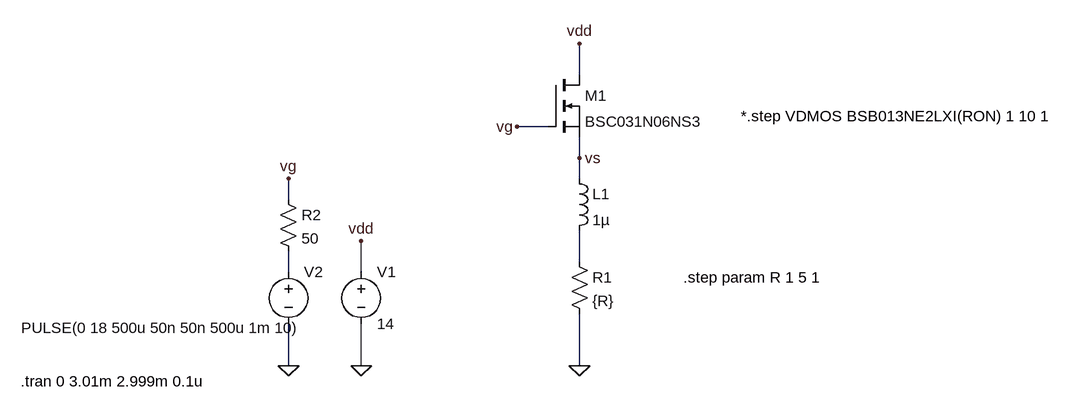
[diagram p0: schematic ind_last.asc]
ind_last.asc, the LTspice schematic file:
Version 4
SHEET 1 1172 680
WIRE 224 -144 224 -192
WIRE 176 -64 128 -64
WIRE 224 -16 224 -48
WIRE 224 16 224 -16
WIRE -224 48 -224 16
WIRE 224 144 224 96
WIRE -224 160 -224 128
WIRE -112 160 -112 112
WIRE -224 304 -224 240
WIRE -112 304 -112 240
WIRE 224 304 224 224
FLAG 224 304 0
FLAG -224 304 0
FLAG -112 304 0
FLAG -112 112 vdd
FLAG -224 16 vg
FLAG 224 -192 vdd
FLAG 128 -64 vg
FLAG 224 -16 vs
SYMBOL voltage -112 144 R0
SYMATTR InstName V1
SYMATTR Value 14
SYMBOL voltage -224 144 R0
WINDOW 3 -411 102 Left 2
WINDOW 123 0 0 Left 2
WINDOW 39 0 0 Left 2
SYMATTR InstName V2
SYMATTR Value PULSE(0 18 500u 50n 50n 500u 1m 10)
SYMBOL nmos 176 -144 R0
SYMATTR InstName M1
SYMATTR Value BSC031N06NS3
SYMBOL ind 208 0 R0
SYMATTR InstName L1
SYMATTR Value 1µ
SYMBOL res 208 128 R0
SYMATTR InstName R1
SYMATTR Value {R}
SYMATTR SpiceLine tol=1 pwr=0.1
SYMBOL res -240 32 R0
SYMATTR InstName R2
SYMATTR Value 50
TEXT -636 328 Left 2 !.tran 0 3.01m 2.999m 0.1u
TEXT 472 -80 Left 2 !*.step VDMOS BSB013NE2LXI(RON) 1 10 1
TEXT 384 168 Left 2 !.step param R 1 5 1

The netlist it stands for:
* ind_last.asc
V1 vdd 0 14
V2 N002 0 PULSE(0 18 500u 50n 50n 500u 1m 10)
M1 vdd vg vs vs BSC031N06NS3
L1 vs N001 1µ
R1 N001 0 {R} tol=1 pwr=0.1
R2 vg N002 50
.model NMOS NMOS
.model PMOS PMOS
.lib standard.mos
.tran 0 3.01m 2.999m 0.1u
*.step VDMOS BSB013NE2LXI(RON) 1 10 1
.step param R 1 5 1
.backanno
.end

* Results of the author's LTspice run, read from the files saved beside the schematic
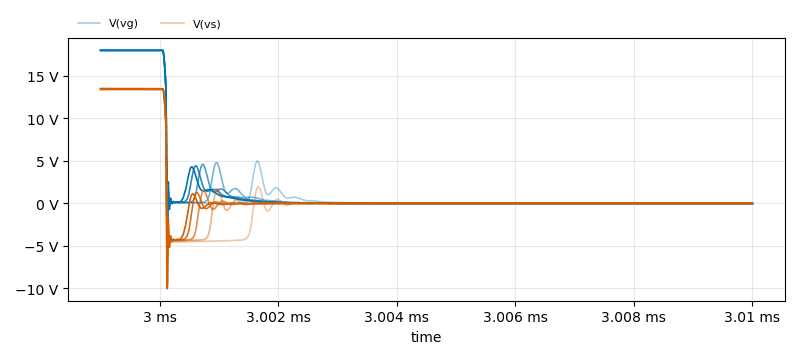
[diagram p1: Transient Analysis of ind_last.asc, plotted from the saved traces]
* Transient Analysis, 9 runs:
*   V(vg) [run 1]: min -2.129 V, max 18 V, average 1.971 V, rms 5.718 V, last 0 V
*   V(vg) [run 2]: 18 V at time=2.999 ms, 18 V at time=2.999 ms, min 18 V, max 18 V
*   V(vg) [run 3]: min -3.089 V, max 18 V, average 1.968 V, rms 5.718 V, last 0 V
*   V(vg) [run 4]: 18 V at time=2.999 ms, 18 V at time=2.999 ms, min 18 V, max 18 V
*   V(vg) [run 5]: min -3.784 V, max 18 V, average 1.967 V, rms 5.717 V, last 0 V
*   V(vg) [run 6]: 18 V at time=2.999 ms, 18 V at time=2.999 ms, min 18 V, max 18 V
*   V(vg) [run 7]: min -4.751 V, max 18 V, average 1.966 V, rms 5.717 V, last 0 V
*   V(vg) [run 8]: 18 V at time=2.999 ms, 18 V at time=2.999 ms, min 18 V, max 18 V
*   V(vs) [run 1]: min -6.828 V, max 13.33 V, average 771.5 mV, rms 4.499 V, last 0 V
*   V(vs) [run 2]: 13.42 V at time=2.999 ms, 13.42 V at time=2.999 ms, min 13.42 V, max 13.42 V
*   V(vs) [run 3]: min -7.732 V, max 13.42 V, average 1.059 V, rms 4.385 V, last 0 V
*   V(vs) [run 4]: 13.46 V at time=2.999 ms, 13.46 V at time=2.999 ms, min 13.46 V, max 13.46 V
*   V(vs) [run 5]: min -8.406 V, max 13.46 V, average 1.153 V, rms 4.351 V, last 0 V
*   V(vs) [run 6]: 13.49 V at time=2.999 ms, 13.49 V at time=2.999 ms, min 13.49 V, max 13.49 V
*   V(vs) [run 7]: min -9.36 V, max 13.49 V, average 1.199 V, rms 4.336 V, last 0 V
*   V(vs) [run 8]: 13.51 V at time=2.999 ms, 13.51 V at time=2.999 ms, min 13.51 V, max 13.51 V